# EAGLE schematic prm_405 (EAGLE 7.3.0)
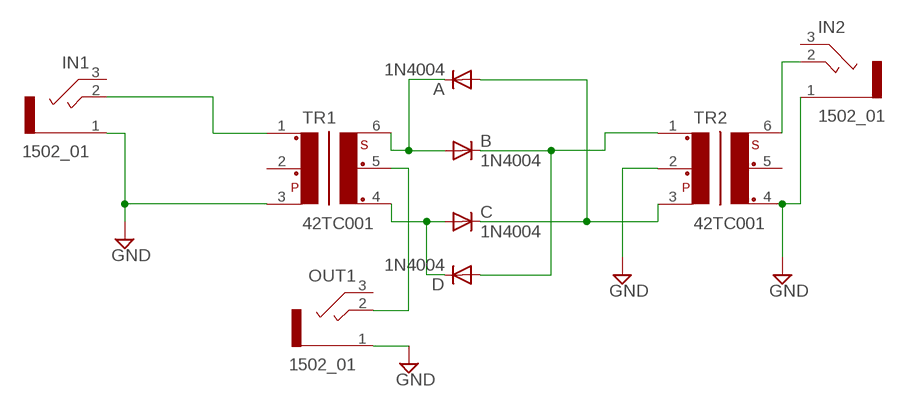
[diagram p0: schematic, sheet 1]

## Parts
A  1N4004  [DO41-10]
B  1N4004  [DO41-10]
C  1N4004  [DO41-10]
D  1N4004  [DO41-10]
IN1  1502_01  [1502_01]
IN2  1502_01  [1502_01]
OUT1  1502_01  [1502_01]
TR1  42TC001  [42TC]
TR2  42TC001  [42TC]

## Nets
A: A.C B.A TR1.6
GND: IN1.1 IN2.1 OUT1.1 TR1.3 TR2.2 TR2.4
N$1: IN1.2 TR1.1
N$2: OUT1.2 TR1.5
N$4: B.C D.A TR2.1
N$5: A.A C.C TR2.3
N$6: C.A D.C TR1.4
N$10: IN2.2 TR2.6
Unconnected: IN1.3 IN2.3 OUT1.3 TR1.2 TR2.5

## Library data of the parts
A B C D = diode:1N4004: DIODE general purpose rectifier, 1 A
IN1 IN2 OUT1 = con-lumberg:1502_01: Jack connectors according to JISC 6560, 3.5 mm Klinkensteckverbinder nach JISC 6560, 3,5 mm Source: http://www.lumberg.com/Produkte/PDFs/1502_01.pdf; OC_FARNELL: 4739747; OC_NEWARK: unknown
TR1 TR2 = trafo-xicon:42T?*: Xicon Micro-Mini EI-12 Audio Transformers 42TL/42TC/42TM Series Source: http://www.mouser.com//catalog/specsheets/164201.pdf http://www.mouser.com/catalog/specsheets/114225.pdf http://www.mouser.com/catalog/specsheets/164267.pdf; OC_FARNELL: unknown; OC_NEWARK: unknown